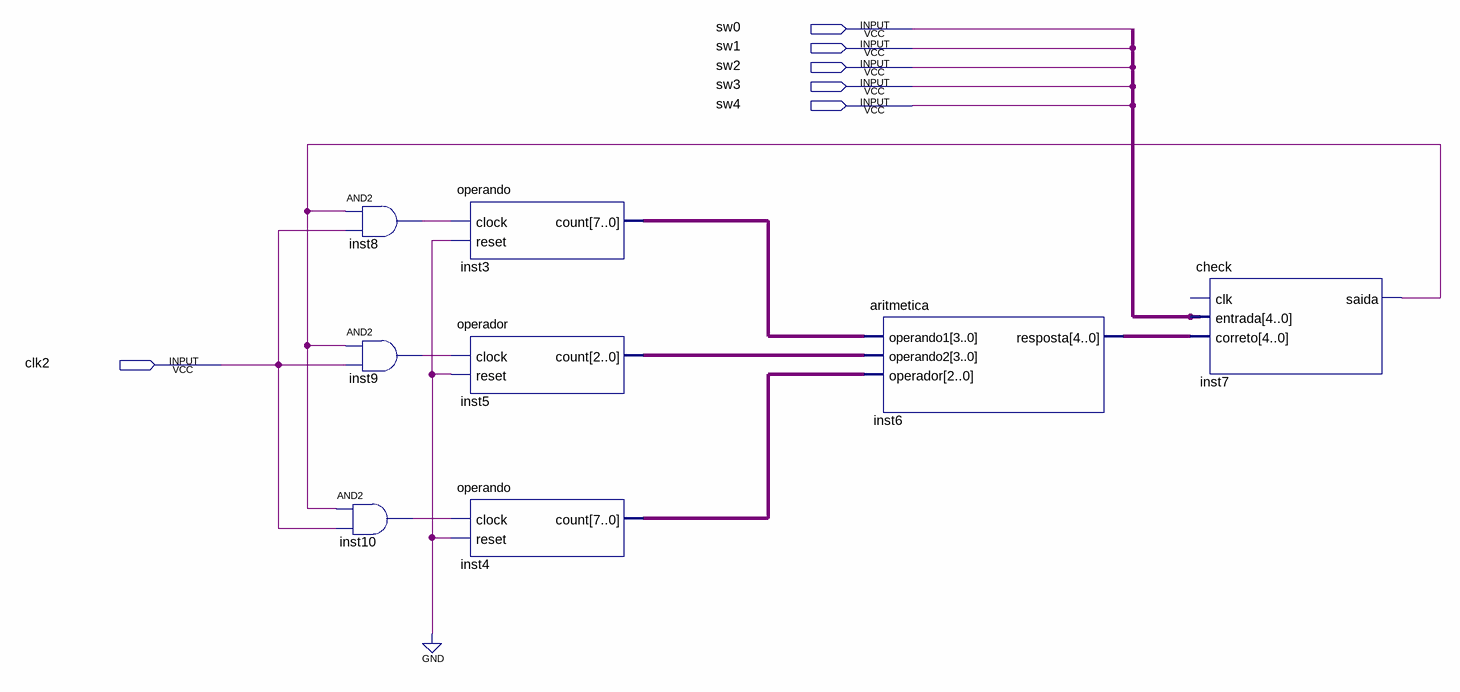
[diagram p0: schematic sheet]
// Quartus schematic projetofinal.bdf as structural Verilog: 8 symbols, 6 pins
module projetofinal (
  input  sw0,
  input  sw1,
  input  sw2,
  input  sw3,
  input  sw4,
  input  clk2
);

  wire inst7_saida, inst8_out, inst9_out, inst10_out;
  wire [3:0] inst5_count;
  wire [4:0] inst6_resposta, undriven;
  wire [7:0] inst3_count, inst4_count;

  and inst8 (inst8_out, inst7_saida, clk2);
  and inst9 (inst9_out, inst7_saida, clk2);
  and inst10 (inst10_out, inst7_saida, clk2);
  operando inst3 (.clock(inst8_out), .reset(1'b0), .count(inst3_count));
  operador inst5 (.clock(inst9_out), .reset(1'b0), .count(inst5_count));
  operando inst4 (.clock(inst10_out), .reset(1'b0), .count(inst4_count));
  aritmetica inst6 (
    .operando1(inst3_count), .operando2(inst5_count), .operador(inst4_count), .resposta(inst6_resposta));
  check inst7 (.entrada(undriven), .correto(inst6_resposta), .saida(inst7_saida));  // open: clk
endmodule
